# EAGLE schematic sensor_v1 (EAGLE 9.2.0)
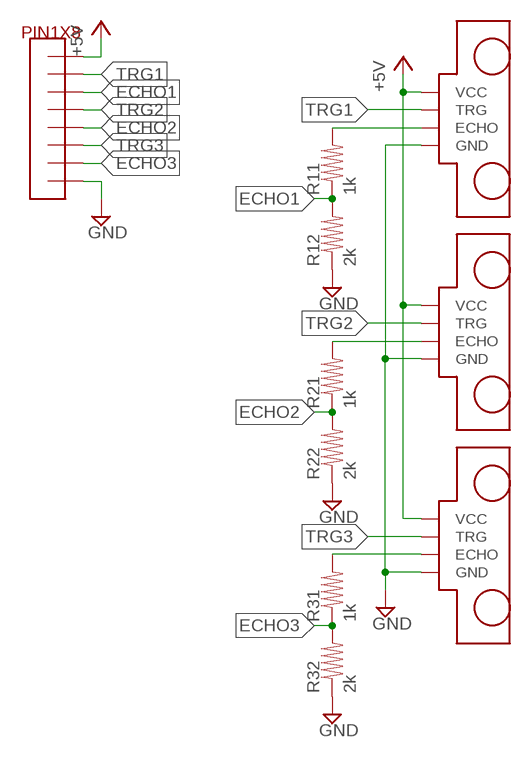
[diagram p0: schematic, sheet 1]

## Parts
R11  1k  SMD_REG0805  [SMD_REG0805]
R12  2k  SMD_REG0805  [SMD_REG0805]
R21  1k  SMD_REG0805  [SMD_REG0805]
R22  2k  SMD_REG0805  [SMD_REG0805]
R31  1k  SMD_REG0805  [SMD_REG0805]
R32  2k  SMD_REG0805  [SMD_REG0805]
U$1  HCSR04  [HCSR04]
U$2  HCSR04  [HCSR04]
U$3  HCSR04  [HCSR04]
U$4  PIN1X8_254  [PIN1X8_254]

## Nets
+5V: U$1.VCC U$2.VCC U$3.VCC U$4.P$1(P1)
ECHO1: R11.P1 R12.P2 U$4.P$3(P3)
ECHO2: R21.P1 R22.P2 U$4.P$5(P5)
ECHO3: R31.P1 R32.P2 U$4.P$7(P7)
GND: R12.P1 R22.P1 R32.P1 U$1.GND U$2.GND U$3.GND U$4.P$8(P8)
N$1: R21.P2 U$2.ECHO
N$2: R11.P2 U$1.ECHO
N$3: R31.P2 U$3.ECHO
TRG1: U$1.TRG U$4.P$2(P2)
TRG2: U$2.TRG U$4.P$4(P4)
TRG3: U$3.TRG U$4.P$6(P6)

## Library data of the parts
R11 R12 R21 R22 R31 R32 = Register:SMD_REG0805
U$1-U$3 = Sensor:HCSR04
U$4 = Pinheader:PIN1X8_254